# EAGLE design schematic1 (EAGLE 7.5.0)
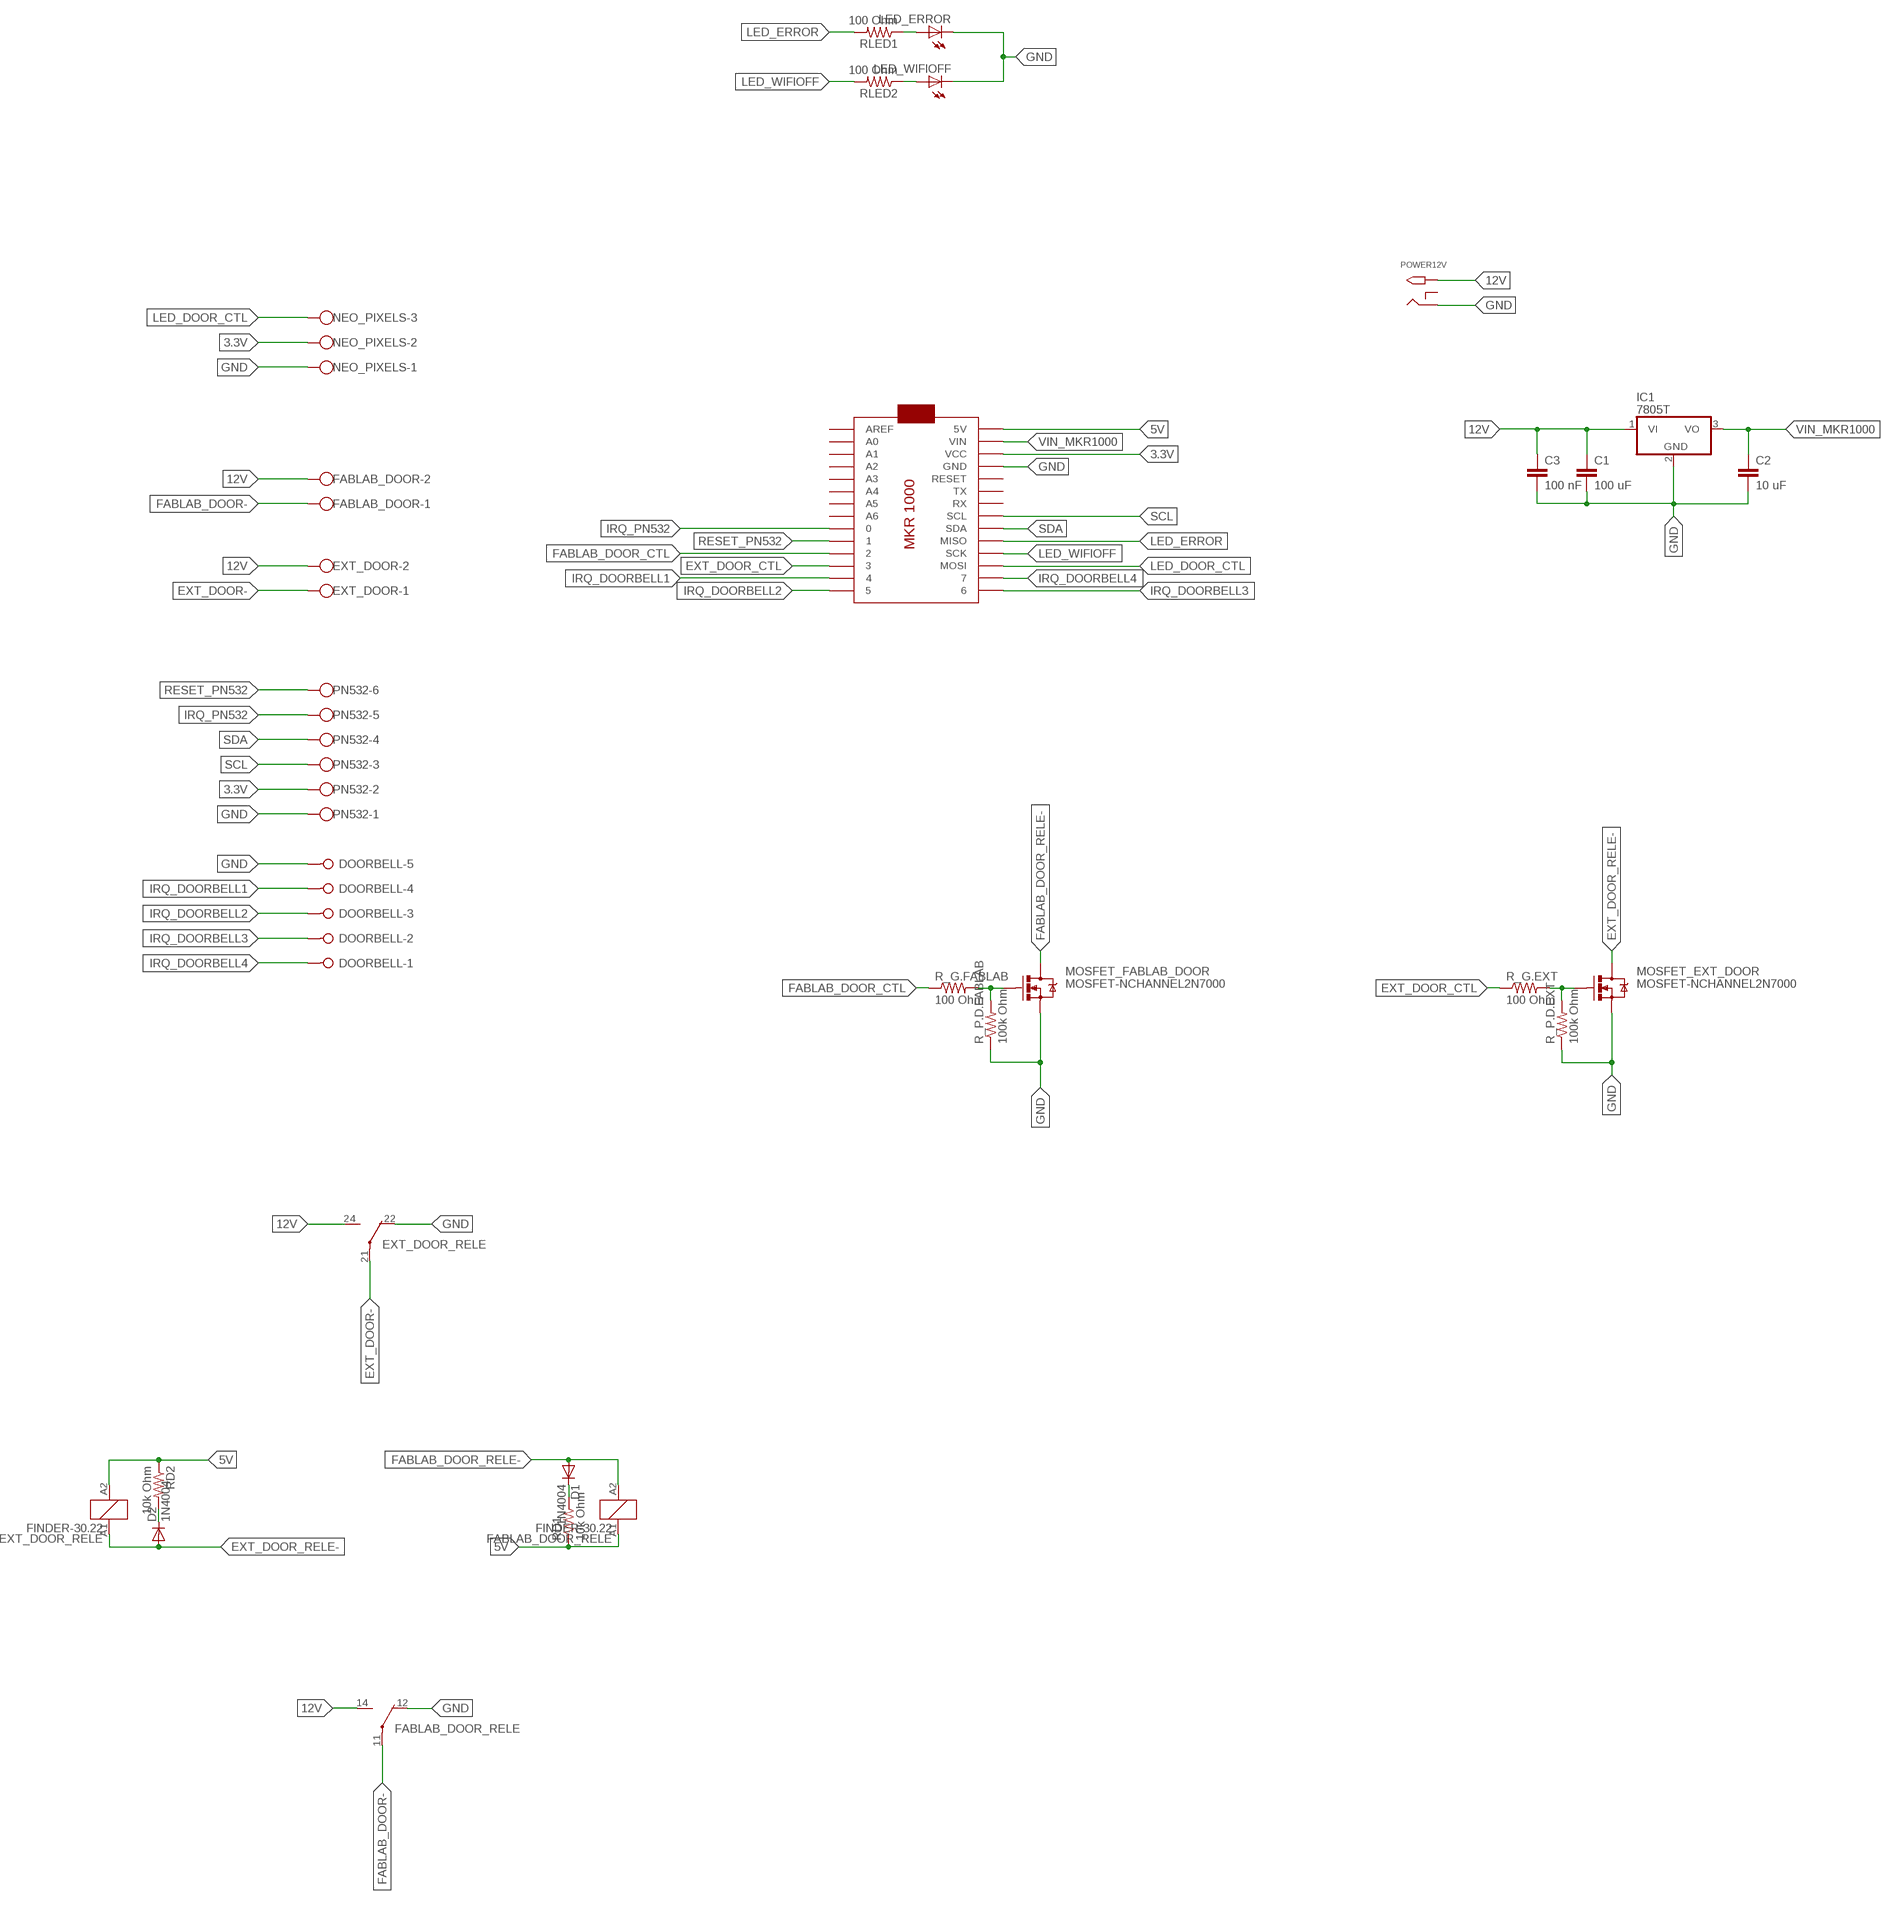
[diagram p0: schematic, sheet 1]

## Parts
C1  100 uF  C2.5/2  [C2.5-2]
C2  10 uF  C2.5/2  [C2.5-2]
C3  100 nF  C2.5/2  [C2.5-2]
D1  1N4004  [DO41-10]
D2  1N4004  [DO41-10]
DOORBELL  W237-05P  [W237-5P]
EXT_DOOR  W237-102  [W237-102]
EXT_DOOR_RELE  FINDER-30.22  [FINDER-30.22]
FABLAB_DOOR  W237-102  [W237-102]
FABLAB_DOOR_RELE  FINDER-30.22  [FINDER-30.22]
IC1  7805T  [TO220H]
LED_ERROR  LED3MM  [LED3MM]
LED_WIFIOFF  LED3MM  [LED3MM]
MOSFET_EXT_DOOR  MOSFET-NCHANNEL2N7000  [TO-92]
MOSFET_FABLAB_DOOR  MOSFET-NCHANNEL2N7000  [TO-92]
NEO_PIXELS  W237-103  [W237-103]
PN532  W237-136  [W237-136]
POWER12V  2.1MMJACKTHM  [PJ-102A]
R_G.EXT  100 Ohm  R-US_0207/10  [0207/10]
R_G.FABLAB  100 Ohm  R-US_0207/10  [0207/10]
R_P.D.EXT  100k Ohm  R-US_0207/10  [0207/10]
R_P.D.FABLAB  100k Ohm  R-US_0207/10  [0207/10]
RD1  10k Ohm  R-US_0207/10  [0207/10]
RD2  10k Ohm  R-US_0207/10  [0207/10]
RLED1  100 Ohm  R-US_0207/10  [0207/10]
RLED2  100 Ohm  R-US_0207/10  [0207/10]
U$1  ARDUINOMKR1000  [ARDUINOMKR1000]

## Nets
3.3V: NEO_PIXELS.2 PN532.2 U$1.VCC
5V: EXT_DOOR_RELE.A2 FABLAB_DOOR_RELE.A1 RD1.1 RD2.1 U$1.5V
12V: C1.1 C3.1 EXT_DOOR.2 EXT_DOOR_RELE.24(-2:S) FABLAB_DOOR.2 FABLAB_DOOR_RELE.14(-1:S) IC1.1(VI) POWER12V.TIP
EXT_DOOR-: EXT_DOOR.1 EXT_DOOR_RELE.21(-2:P)
EXT_DOOR_CTL: R_G.EXT.1 U$1.3
EXT_DOOR_RELE-: D2.A EXT_DOOR_RELE.A1 MOSFET_EXT_DOOR.3(D)
FABLAB_DOOR-: FABLAB_DOOR.1 FABLAB_DOOR_RELE.11(-1:P)
FABLAB_DOOR_CTL: R_G.FABLAB.1 U$1.2
FABLAB_DOOR_RELE-: D1.A FABLAB_DOOR_RELE.A2 MOSFET_FABLAB_DOOR.3(D)
GND: C1.2 C2.2 C3.2 DOORBELL.5 EXT_DOOR_RELE.22(-2:O) FABLAB_DOOR_RELE.12(-1:O) IC1.2(GND) LED_ERROR.K(C) LED_WIFIOFF.K(C) MOSFET_EXT_DOOR.1(S) MOSFET_FABLAB_DOOR.1(S) NEO_PIXELS.1 PN532.1 POWER12V.RING R_P.D.EXT.1 R_P.D.FABLAB.1 U$1.GND
IRQ_DOORBELL1: DOORBELL.4 U$1.4
IRQ_DOORBELL2: DOORBELL.3 U$1.5
IRQ_DOORBELL3: DOORBELL.2 U$1.6
IRQ_DOORBELL4: DOORBELL.1 U$1.7
IRQ_PN532: PN532.5 U$1.0
LED_DOOR_CTL: NEO_PIXELS.3 U$1.MOSI
LED_ERROR: RLED1.2 U$1.MISO
LED_WIFIOFF: RLED2.2 U$1.SCK
N$1: MOSFET_FABLAB_DOOR.2(G) R_G.FABLAB.2 R_P.D.FABLAB.2
N$2: MOSFET_EXT_DOOR.2(G) R_G.EXT.2 R_P.D.EXT.2
N$3: D2.C RD2.2
N$4: D1.C RD1.2
N$9: LED_ERROR.A RLED1.1
N$10: LED_WIFIOFF.A RLED2.1
RESET_PN532: PN532.6 U$1.1
SCL: PN532.3 U$1.SCL
SDA: PN532.4 U$1.SDA
VIN_MKR1000: C2.1 IC1.3(VO) U$1.VIN
Unconnected: EXT_DOOR_RELE.11(-1:P) EXT_DOOR_RELE.12(-1:O) EXT_DOOR_RELE.14(-1:S) FABLAB_DOOR_RELE.21(-2:P) FABLAB_DOOR_RELE.22(-2:O) FABLAB_DOOR_RELE.24(-2:S) POWER12V.RING_SW U$1.A0 U$1.A1 U$1.A2 U$1.A3 U$1.A4 U$1.A5 U$1.A6 U$1.AREF U$1.RESET U$1.RX U$1.TX

## Library data of the parts
C1-C3 = capacitor-wima:C: CAPACITOR naming: grid - package width
D1 D2 = adafruit:1N4004: DIODE General purpose 1N400x type rectifier (With bigger pads) http://www.ladyada.net/library/pcb/eaglelibrary.html
DOORBELL = con-wago-508:W237-05P: WAGO SREW CLAMP; OC_FARNELL: unknown; OC_NEWARK: unknown
EXT_DOOR FABLAB_DOOR = con-wago-500:W237-102: WAGO SCREW CLAMP; MPN: 237-102; OC_FARNELL: unknown; OC_NEWARK: 70K9898
EXT_DOOR_RELE FABLAB_DOOR_RELE = relay:FINDER-30.22: SUBMINIATURE DIL-RELAIS FINDER 30.22.9.024.0000 Kontakt max. AC - 125V Distributor: Farnell Bestell Nr.: 1217371 Source: http://www.farnell.com/datasheets/87634.pdf; OC_FARNELL: unknown; OC_NEWARK: unknown
IC1 = adafruit:78*: Positive VOLTAGE REGULATOR Added bigger pads to the TO-92 package
LED_ERROR LED_WIFIOFF = led:LED: LED OSRAM: - CHIPLED LG R971, LG N971, LY N971, LG Q971, LY Q971, LO R971, LY R971 LH N974, LH R974 LS Q976, LO Q976, LY Q976 LO Q996 - Hyper CHIPLED LW Q18S LB Q993, LB Q99A, LB R99A - SideLED LS A670, LO A670, LY A670, LG A670, LP A670 LB A673, LV A673, LT A673, LW A673 LH A674 LY A675 LS A676, LA A676, LO A676, LY A676, LW A676 LS A679, LY A679, LG A679 - Hyper Micro SIDELED® LS Y876, LA Y876, LO Y876, LY Y876 LT Y87S - SmartLED LW L88C, LW L88S LB L89C, LB L89S, LG L890 LS L89K, LO L89K, LY L89K LS L896, LA L896, LO L896, LY L896 - TOPLED LS T670, LO T670, LY T670, LG T670, LP T670 LSG T670, LSP T670, LSY T670, LOP T670, LYG T670 LG T671, LOG T671, LSG T671 LB T673, LV T673, LT T673, LW T673 LH T674 LS T676, LA T676, LO T676, LY T676, LB T676, LH T676, LSB T676, LW T676 LB T67C, LV T67C, LT T67C, LS T67K, LO T67K, LY T67K, LW E67C LS E67B, LA E67B, LO E67B, LY E67B, LB E67C, LV E67C, LT E67C LW T67C LS T679, LY T679, LG T679 LS T770, LO T770, LY T770, LG T770, LP T770 LB T773, LV T773, LT T773, LW T773 LH T774 LS E675, LA E675, LY E675, LS T675 LS T776, LA T776, LO T776, LY T776, LB T776 LHGB T686 LT T68C, LB T68C - Hyper Mini TOPLED® LB M676 - Mini TOPLED Santana® LG M470 LS M47K, LO M47K, LY M47K Source: http://www.osram.convergy.de LUXEON: - LUMILED® LXK2-PW12-R00, LXK2-PW12-S00, LXK2-PW14-U00, LXK2-PW14-V00 LXK2-PM12-R00, LXK2-PM12-S00, LXK2-PM14-U00 LXK2-PE12-Q00, LXK2-PE12-R00, LXK2-PE12-S00, LXK2-PE14-T00, LXK2-PE14-U00 LXK2-PB12-K00, LXK2-PB12-L00, LXK2-PB12-M00, LXK2-PB14-N00, LXK2-PB14-P00, LXK2-PB14-Q00 LXK2-PR12-L00, LXK2-PR12-M00, LXK2-PR14-Q00, LXK2-PR14-R00 LXK2-PD12-Q00, LXK2-PD12-R00, LXK2-PD12-S00 LXK2-PH12-R00, LXK2-PH12-S00 LXK2-PL12-P00, LXK2-PL12-Q00, LXK2-PL12-R00 Source: www.luxeon.com KINGBRIGHT: KA-3528ASYC Source: www.kingbright.com
MOSFET_EXT_DOOR MOSFET_FABLAB_DOOR = SparkFun-DiscreteSemi:MOSFET-NCHANNEL: Common NMOSFET Parts MFG P/N Store ID Prod ID FDD8780 TRANS-09984 SI7820DN TRANS-11055 FDS6630A IC-08089 2N7002PW TRANS-11151 FQP30N06L COM-10213 TRANS-10060 BSS123LT1G TRANS-08345 BSS138 TRANS-00830 BS170 2N7000
NEO_PIXELS = con-wago-500:W237-103: WAGO SCREW CLAMP; MPN: 237-103; OC_FARNELL: unknown; OC_NEWARK: 18M7116
PN532 = con-wago-500:W237-136: WAGO SCREW CLAMP; MPN: 237-136; OC_FARNELL: unknown; OC_NEWARK: 84K9151
POWER12V = adafruit:2.1MMJACK: 2.1mm x 5.5mm THM DC jack with internal switch. Digikey part #PJ-102A, 4UCON part #05537 2.1mm x 5.5mm SMT DC jack with internal switch. Digikey part #PJ-002A-SMT, 4UCON part #03267 By microbuilder.eu & adafruit.com
R_G.EXT R_G.FABLAB R_P.D.EXT R_P.D.FABLAB RD1 RD2 RLED1 RLED2 = adafruit:R-US_: RESISTOR, American symbol
U$1 = adafruit:ARDUINOMKR1000

## Net classes
0 default: width 0.5 mm, drill 0.8 mm, clearance 0.5 mm

## Board
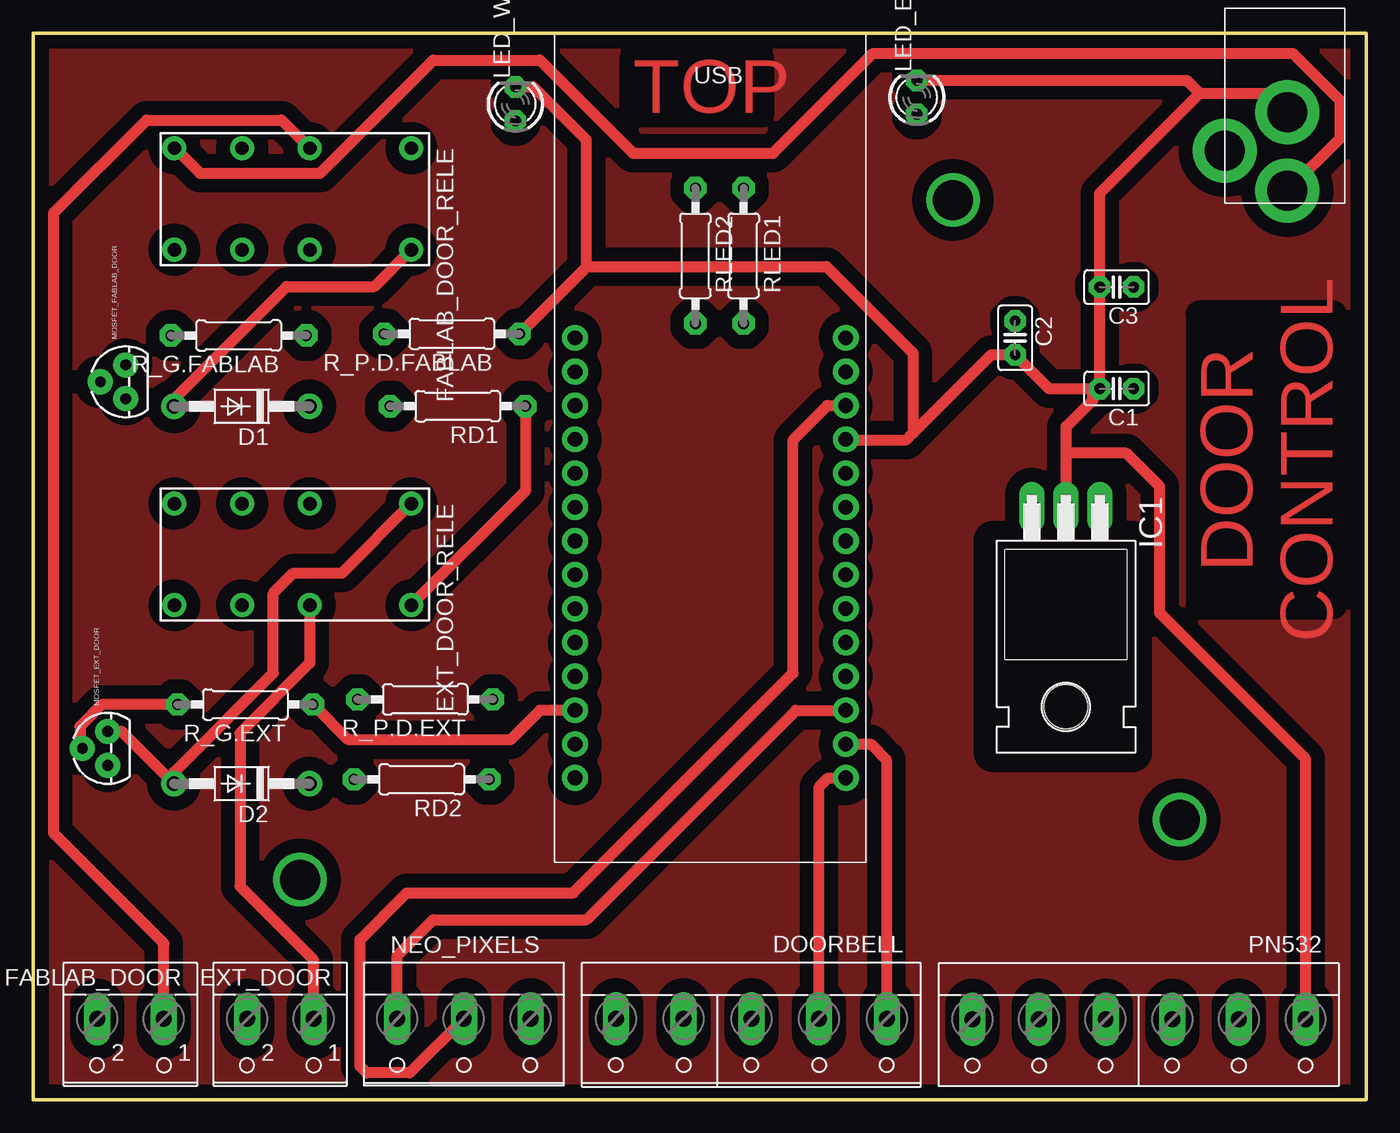
[diagram p1: board, top side]
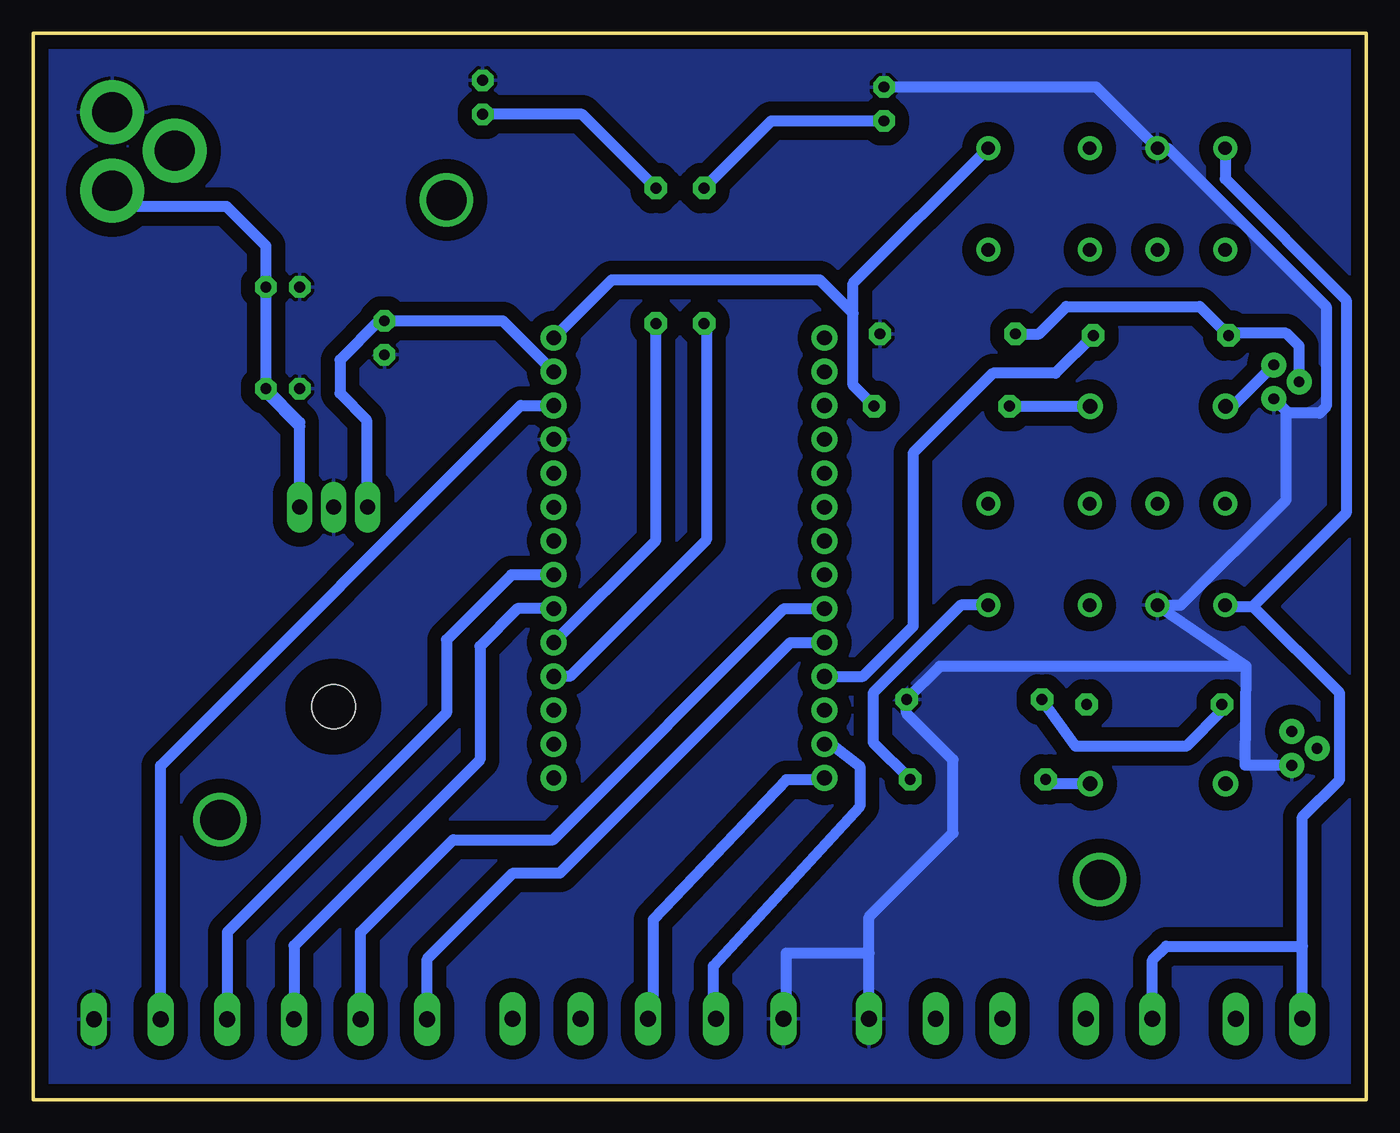
[diagram p2: board, bottom side, seen from below]

Size 100 x 80 mm. Coordinates in mm from the lower left corner, seen from the top.
Outline: 0,0 100,0 100,80 0,80 0,0
Copper layers (1*16): Top 0.035mm / dielectric 1.5mm / Bottom 0.035mm
Design rules "default *": minimum track width 10mil, minimum drill 24mil, track to track 8mil, track to pad 8mil, pad to pad 8mil, via to via 8mil, smd to smd 8mil, copper to edge 40mil, drill to drill 8mil, minimum pad ring 0.4mm, minimum via ring 8mil, stop-mask expansion 4mil, vias tented up to drill 0mil, thermal gap 10mil
tRestrict: area 72,26 to 82.5,42

### Footprints (pad centres in the part's own frame; a part is rotated, then mirrored left to right if it is on the bottom)
C2.5-2 = drill 0.813 pad 1.6 octagon: 1 -1.27,0; 2 1.27,0
DO41-10 = drill 1.118 pad 1.93: A 5.08,0; C -5.08,0
W237-5P = drill 1.194 long: 1 -10.16,-0.635; 2 -5.08,-0.635; 3 0,-0.635; 4 5.08,-0.635; 5 10.16,-0.635
W237-102 = drill 1.194 long: 1 -2.5,-1.27; 2 2.5,-1.27
FINDER-30.22 = drill 1 pad 1.6: 11 -1.27,-3.81; 12 3.81,-3.81; 14 8.89,-3.81; 21 -1.27,3.81; 22 3.81,3.81; 24 8.89,3.81; A1 -8.89,-3.81; A2 -8.89,3.81
TO220H = drill 1.118 long: 1 -2.54,-10.16; 2 0,-10.16; 3 2.54,-10.16 | hole 3.302: 0,4.826
LED3MM = drill 0.813 octagon: A -1.27,0; K 1.27,0
TO-92 = drill 0.813 pad 1.88: 1 -1.27,0; 2 0,1.905; 3 1.27,0
W237-103 = drill 1.194 long: 1 -5,-1.29; 2 0,-1.29; 3 5,-1.29
W237-136 = drill 1.194 long: 1 -12.5,-1.27; 2 -7.5,-1.27; 3 -2.5,-1.27; 4 2.5,-1.27; 5 7.5,-1.27; 6 12.5,-1.27
PJ-102A = drill 3 pad 4.8: RING 0.1,-3.39; RING_SW -4.6,-6.29; TIP 0.1,-9.29
0207/10 = drill 0.813 pad 1.676 octagon: 1 -5.08,0; 2 5.08,0
ARDUINOMKR1000 = drill 1.1 pad 1.93: 0 -3.81,-7.62; 1 -1.27,-7.62; 2 1.27,-7.62; 3 3.81,-7.62; 4 6.35,-7.62; 5 8.89,-7.62; 5V -24.13,12.7; 6 8.89,12.7; 7 6.35,12.7; A0 -21.59,-7.62; A1 -19.05,-7.62; A2 -16.51,-7.62; A3 -13.97,-7.62; A4 -11.43,-7.62; A5 -8.89,-7.62; A6 -6.35,-7.62; AREF -24.13,-7.62; GND -16.51,12.7; MISO -1.27,12.7; MOSI 3.81,12.7; RESET -13.97,12.7; RX -8.89,12.7; SCK 1.27,12.7; SCL -6.35,12.7; SDA -3.81,12.7; TX -11.43,12.7; VCC -19.05,12.7; VIN -21.59,12.7

### Placement (x,y rotation side)
C1  81.28,53.34 180 top
C2  73.66,57.15 270 top
C3  81.28,60.96 180 top
D1  15.63,52.01 180 top
D2  15.63,23.7 180 top
DOORBELL  53.87,5.42 180 top
EXT_DOOR  18.53,4.78 180 top
EXT_DOOR_RELE  19.47,40.9 180 top
FABLAB_DOOR  7.29,4.78 180 top
FABLAB_DOOR_RELE  19.47,67.57 180 top
IC1  77.47,34.29 180 top
LED_ERROR  66.29,75.2 90 top
LED_WIFIOFF  36.17,74.7 90 top
MOSFET_EXT_DOOR  5.59,26.35 90 top
MOSFET_FABLAB_DOOR  6.94,53.85 90 top
NEO_PIXELS  32.3,4.78 180 top
PN532  82.95,4.75 180 top
POWER12V  93.98,77.47 0 top
R_G.EXT  15.9,29.64 180 top
R_G.FABLAB  15.4,57.33 180 top
R_P.D.EXT  29.4,30.02 180 top
R_P.D.FABLAB  31.4,57.45 180 top
RD1  31.84,52.02 180 top
RD2  29.13,24.02 180 top
RLED1  53.29,63.31 270 top
RLED2  49.67,63.31 270 top
U$1  48.26,33.02 270 top

### Tracks (layer width: path | path; a pad name or v marks a point on that pad's centre or on a via)
3.3V
  Top 0.813: NEO_PIXELS.2 28.23,2 25,2 24.5,2.5 24.5,12 28,15.5 40.5,15.5 57,32 57,49.5 59.57,52.07 U$1.VCC
  Bottom 0.813: PN532.2 90.45,25.05 63.43,52.07 U$1.VCC
5V
  Top 0.813: RD1.1 36.92,45.65 EXT_DOOR_RELE.A2
  Bottom 0.813: RD1.1 38.5,53.6 38.5,59 | EXT_DOOR_RELE.A2 30.41,37.09 37,30.5 37,26.81 RD2.1 | 38.5,59 41,61.5 56.61,61.5 U$1.5V | 38.5,59 38.5,61.24 FABLAB_DOOR_RELE.A1
12V
  Top 0.813: FABLAB_DOOR_RELE.14 11,71 12.5,69.5 21.5,69.5 30,78 38,78 45,71 55.5,71 63,78.5 94.5,78.5 98,75 98,72.1 POWER12V.TIP
  Bottom 0.813: FABLAB_DOOR_RELE.14 10.58,69.08 1.5,60 1.5,44 8.5,37 | FABLAB_DOOR.2 4.79,11.5 | 4.79,11.5 4.79,21.21 2,24 2,30.5 8.5,37 | 82.5,53 80.01,50.51 IC1.1 80.01,50.8 C1.1 C3.1 82.55,64.05 85.5,67 92.9,67 POWER12V.TIP | EXT_DOOR.2 16.03,10.47 15,11.5 4.79,11.5 | EXT_DOOR_RELE.24 10.49,37 8.5,37
EXT_DOOR-
  Top 0.813: EXT_DOOR_RELE.21 20.74,32.74 15.5,27.5 15.5,16 21.03,10.47 EXT_DOOR.1
EXT_DOOR_CTL
  Top 0.813: U$1.3 38,29.2 35.8,27 23.62,27 R_G.EXT.1
EXT_DOOR_RELE-
  Top 0.813: MOSFET_EXT_DOOR.3 6.63,27.62 D2.A 10.55,24.55 18,32 18,38 19.5,39.5 23.15,39.5 EXT_DOOR_RELE.A1
FABLAB_DOOR-
  Top 0.813: FABLAB_DOOR.1 9.79,11.71 1.5,20 1.5,66.5 8.5,73.5 18.62,73.5 FABLAB_DOOR_RELE.11
FABLAB_DOOR_CTL
  Bottom 0.813: R_G.FABLAB.1 23.31,54.5 28,54.5 34,48.5 34,35.5 37.75,31.75 U$1.2
FABLAB_DOOR_RELE-
  Top 0.813: D1.A 10.55,52.55 19,61 25.6,61 FABLAB_DOOR_RELE.A2
  Bottom 0.813: D1.A 10.05,52.01 MOSFET_FABLAB_DOOR.3
GND
  Top 0.813: U$1.GND 60.99,49.5 65.5,49.5 66,50 | 66,50 71.88,55.88 C2.2 76.2,53.34 79.5,53.34 | 79.5,53.34 C1.2 C3.2 80,68 87.5,75.5 | 77.5,48.5 77.5,44.48 IC1.2 77.5,44.42 | 77.5,48.5 77.5,50.5 79.5,52.5 79.5,53.34 | 87.5,75.5 92.66,75.5 POWER12V.RING | PN532.1 95.45,25.55 84.5,36.5 84.5,46 82,48.5 77.5,48.5 | R_P.D.FABLAB.1 41.53,62.5 | 41.53,62.5 59.5,62.5 66,56 66,50 | 41.53,62.5 41.5,62.53 41.5,72 37.53,75.97 LED_WIFIOFF.K | LED_ERROR.K 86.53,76.47 87.5,75.5
  Bottom 0.813: MOSFET_EXT_DOOR.1 9.08,25.08 9,32.5 | 9,32.5 15.5,36.93 EXT_DOOR_RELE.22 13.91,37.09 6,45 6,51.64 MOSFET_FABLAB_DOOR.1 5.86,51.5 3.5,51.5 3,52 3,59.5 14.88,71.38 FABLAB_DOOR_RELE.12 20.25,75.97 LED_WIFIOFF.K | 9,32.5 32,32.5 R_P.D.EXT.1 34.48,28.98 31,25.5 31,20 37.3,13.7 37.3,11 | NEO_PIXELS.1 37.3,11 | DOORBELL.5 43.5,6.05 43.5,11 37.3,11
  pour Bottom (isolate 1.041, rank 6): 0,80 0,0 100,0 100,80
IRQ_DOORBELL1
  Bottom 0.813: U$1.4 40.17,26.67 38,25 38,22 49,10 49,6.26 DOORBELL.4
IRQ_DOORBELL2
  Bottom 0.813: U$1.5 40.5,24.13 40.5,24 43.5,24 53.5,13.5 53.5,6.42 DOORBELL.3
IRQ_DOORBELL3
  Top 0.813: DOORBELL.2 58.95,23.45 59.63,24.13 U$1.6
IRQ_DOORBELL4
  Top 0.813: U$1.7 62.83,26.67 64,25.5 64,6.08 DOORBELL.1
IRQ_PN532
  Bottom 0.813: U$1.0 43.67,36.83 61,19.5 68.5,19.5 75.45,12.55 PN532.5
LED_DOOR_CTL
  Top 0.813: NEO_PIXELS.3 27.3,10.8 30,13.5 41.5,13.5 57.21,29.21 U$1.MOSI
LED_ERROR
  Bottom 0.813: U$1.MISO 53.29,41.96 RLED1.2
LED_WIFIOFF
  Bottom 0.813: RLED2.2 49.5,58.23 49.5,42 59.75,31.75 U$1.SCK
N$1
  Bottom 0.813: R_P.D.FABLAB.2 24.55,57.45 22.5,59.5 12.49,59.5 R_G.FABLAB.2 10.15,57.5 6,57.5 5.04,56.53 MOSFET_FABLAB_DOOR.2
N$2
  Top 0.813: R_G.EXT.2 5.14,29.64 3.5,28 3.5,26.54 MOSFET_EXT_DOOR.2
  Bottom 0.813: R_G.EXT.2 10.82,29.18 13.5,26.5 21.8,26.5 R_P.D.EXT.2
N$3
  Bottom 0.813: D2.C 23.73,23.7 RD2.2
N$4
  Bottom 0.813: D1.C RD1.2
N$5  (via drill 3)
  other vias: 69,67.5
N$6  (via drill 3)
  other vias: 20,16.5
N$7  (via drill 3)
  other vias: 86,21
N$8
  pour Top (isolate 1.041, rank 6): 0,80 0,0 100,0 100,80
N$9
  Bottom 0.813: RLED1.1 58.83,73.93 LED_ERROR.A
N$10
  Bottom 0.813: RLED2.1 44.63,73.43 LED_WIFIOFF.A
RESET_PN532
  Bottom 0.813: PN532.6 70.45,10.55 64,17 60.5,17 43.21,34.29 U$1.1
SCL
  Bottom 0.813: PN532.3 85.45,12.55 69,29 69,34.5 64.13,39.37 U$1.SCL
SDA
  Bottom 0.813: U$1.SDA 63.67,36.83 66.5,34 66.5,25.5 80.45,11.55 PN532.4
VIN_MKR1000
  Bottom 0.813: U$1.VIN 64.77,58.42 C2.1 74.08,58.42 77,55.5 77,53 75,51 75,44.52 IC1.3

### Text on the board
Top: TOP | DOOR / CONTROL